# Altium schematic sheet Sheet1.SchDoc: Microcontroller part
size A; Author: K.Senthurbavan; DrawnBy: K Senthurbavan
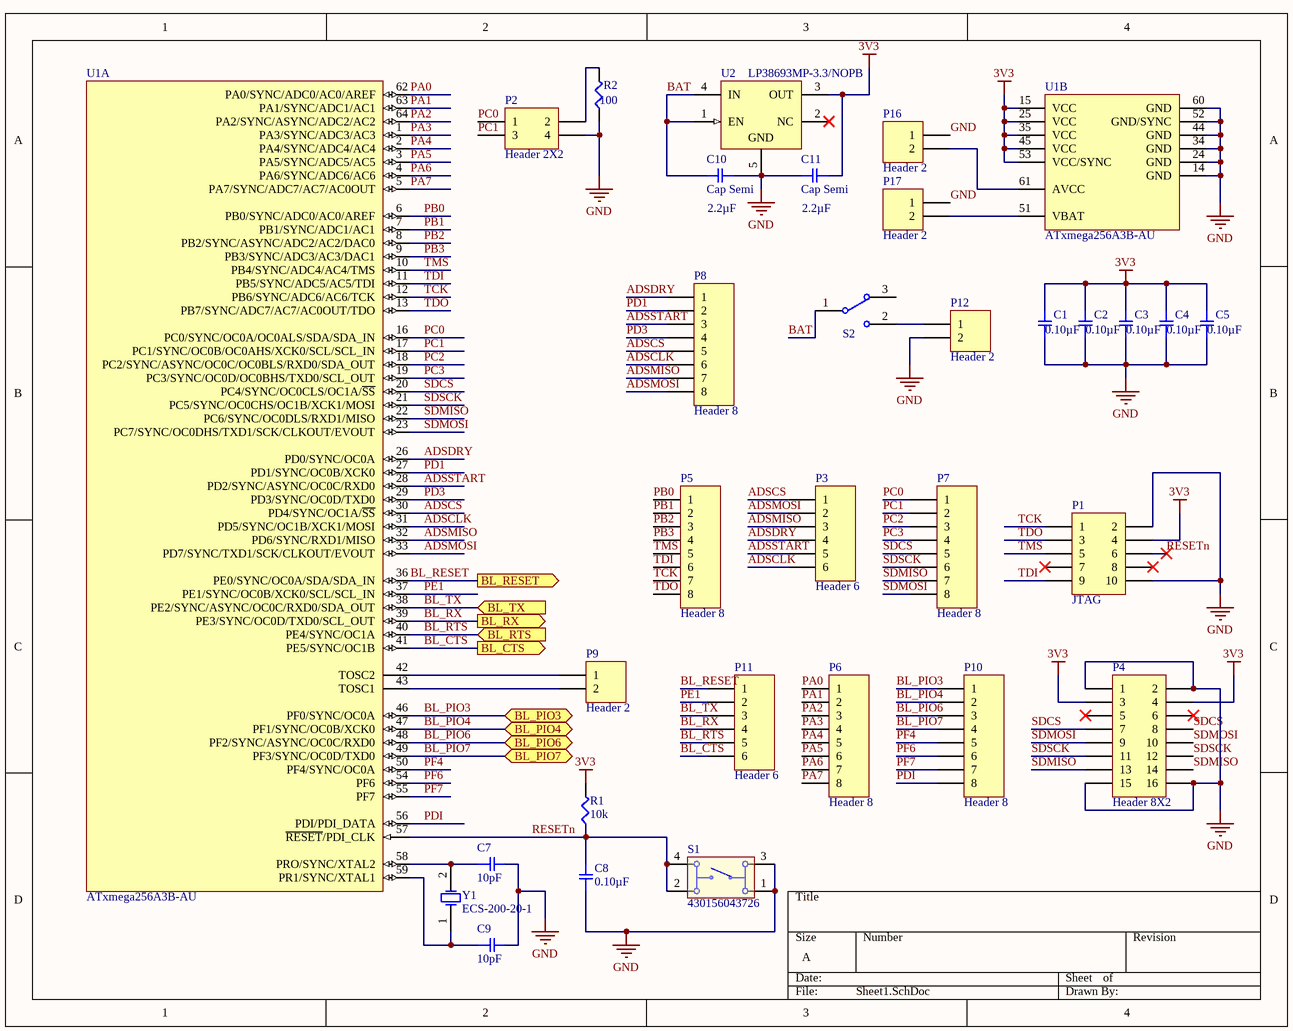
[diagram p0: Sheet1.SchDoc]

## Parts
C1  0.10µF  [SMD-0805C]
C2  0.10µF  [SMD-0805C]
C3  0.10µF  [SMD-0805C]
C4  0.10µF  [SMD-0805C]
C5  0.10µF  [SMD-0805C]
C7  10pF  [SMD-1206C]
C8  0.10µF  [SMD-0805C]
C9  10pF  [SMD-1206C]
C10  Cap Semi  value 2.2µF  [C1206]
C11  Cap Semi  value 2.2µF  [C1206]
P1  JTAG  [HDR2X5]
P2  Header 2X2  [HDR2X2]
P3  Header 6  [HDR1X6]
P4  Header 8X2  [HDR2X8]
P5  Header 8  [HDR1X8]
P6  Header 8  [HDR1X8]
P7  Header 8  [HDR1X8]
P8  Header 8  [HDR1X8]
P9  Header 2  [HDR1X2]
P10  Header 8  [HDR1X8]
P11  Header 6  [HDR1X6]
P12  Header 2  [HDR1X2]
P16  Header 2  [HDR1X2]
P17  Header 2  [HDR1X2]
R1  10k  [SMD-1206-RES]
R2  100  [SMD-0805-RES]
S1  430156043726  [430156043726]
S2  450301014042  [450301014042]  (value not drawn)
U1  ATxmega256A3B-AU  [64A_N]  (parts A,B of 2)
U2  LP38693MP-3.3/NOPB  [MP05A_N]
Y1  ECS-200-20-1  [HC-49U]

## Ports
BL_CTS (out), BL_PIO3 (bidir), BL_PIO4 (bidir), BL_PIO6 (bidir), BL_PIO7 (bidir), BL_RESET (out), BL_RTS (in), BL_RX (out), BL_TX (in)

## Nets
3V3: C1.2 C2.2 C3.2 C4.2 C5.2 C11.1 P1.4 P4.3 P4.4 R1.2 U1.15(VCC) U1.25(VCC) U1.35(VCC) U1.45(VCC) U1.53(VCC/SYNC) U2.3(OUT)
GND: C1.1 C2.1 C3.1 C4.1 C5.1 C7.2 C8.1 C9.2 C10.1 C11.2 P1.2 P1.10 P2.4 P4.1 P4.2 P4.15 P4.16 P12.2 P16.1 P17.1 R2.1 S1.1 S1.3 U1.14(GND) U1.24(GND) U1.34(GND) U1.44(GND) U1.52(GND/SYNC) U1.60(GND) U2.5(GND)
ADSCLK: P3.6 P8.6 U1.31(PD5/SYNC/OC1B/XCK1/MOSI)
ADSCS: P3.1 P8.5 U1.30(PD4/SYNC/OC1A/~{SS})
ADSDRY: P3.4 P8.1 U1.26(PD0/SYNC/OC0A)
ADSMISO: P3.3 P8.7 U1.32(PD6/SYNC/RXD1/MISO)
ADSMOSI: P3.2 P8.8 U1.33(PD7/SYNC/TXD1/SCK/CLKOUT/EVOUT)
ADSSTART: P3.5 P8.3 U1.28(PD2/SYNC/ASYNC/OC0C/RXD0)
BAT: C10.2 S2.1(COM) U2.1(EN) U2.4(IN)
BL_CTS: P11.6 U1.41(PE5/SYNC/OC1B) ; port BL_CTS
BL_PIO3: P10.1 U1.46(PF0/SYNC/OC0A) ; port BL_PIO3
BL_PIO4: P10.2 U1.47(PF1/SYNC/OC0B/XCK0) ; port BL_PIO4
BL_PIO6: P10.3 U1.48(PF2/SYNC/ASYNC/OC0C/RXD0) ; port BL_PIO6
BL_PIO7: P10.4 U1.49(PF3/SYNC/OC0D/TXD0) ; port BL_PIO7
BL_RESET: P11.1 U1.36(PE0/SYNC/OC0A/SDA/SDA_IN) ; port BL_RESET
BL_RTS: P11.5 U1.40(PE4/SYNC/OC1A) ; port BL_RTS
BL_RX: P11.4 U1.39(PE3/SYNC/OC0D/TXD0/SCL_OUT) ; port BL_RX
BL_TX: P11.3 U1.38(PE2/SYNC/ASYNC/OC0C/RXD0/SDA_OUT) ; port BL_TX
PA0: P6.1 U1.62(PA0/SYNC/ADC0/AC0/AREF)
PA1: P6.2 U1.63(PA1/SYNC/ADC1/AC1)
PA2: P6.3 U1.64(PA2/SYNC/ASYNC/ADC2/AC2)
PA3: P6.4 U1.1(PA3/SYNC/ADC3/AC3)
PA4: P6.5 U1.2(PA4/SYNC/ADC4/AC4)
PA5: P6.6 U1.3(PA5/SYNC/ADC5/AC5)
PA6: P6.7 U1.4(PA6/SYNC/ADC6/AC6)
PA7: P6.8 U1.5(PA7/SYNC/ADC7/AC7/AC0OUT)
PB0: P5.1 U1.6(PB0/SYNC/ADC0/AC0/AREF)
PB1: P5.2 U1.7(PB1/SYNC/ADC1/AC1)
PB2: P5.3 U1.8(PB2/SYNC/ASYNC/ADC2/AC2/DAC0)
PB3: P5.4 U1.9(PB3/SYNC/ADC3/AC3/DAC1)
PC0: P2.1 P7.1 U1.16(PC0/SYNC/OC0A/OC0ALS/SDA/SDA_IN)
PC1: P2.3 P7.2 U1.17(PC1/SYNC/OC0B/OC0AHS/XCK0/SCL/SCL_IN)
PC2: P7.3 U1.18(PC2/SYNC/ASYNC/OC0C/OC0BLS/RXD0/SDA_OUT)
PC3: P7.4 U1.19(PC3/SYNC/OC0D/OC0BHS/TXD0/SCL_OUT)
PD1: P8.2 U1.27(PD1/SYNC/OC0B/XCK0)
PD3: P8.4 U1.29(PD3/SYNC/OC0D/TXD0)
PDI: P10.8 U1.56(PDI/PDI_DATA)
PE1: P11.2 U1.37(PE1/SYNC/OC0B/XCK0/SCL/SCL_IN)
PF4: P10.5 U1.50(PF4/SYNC/OC0A)
PF6: P10.6 U1.54(PF6)
PF7: P10.7 U1.55(PF7)
RESETn: C8.2 P1.6 R1.1 S1.2 S1.4 U1.57(~{RESET}/PDI_CLK)
SDCS: P4.7 P4.8 P7.5 U1.20(PC4/SYNC/OC0CLS/OC1A/~{SS})
SDMISO: P4.13 P4.14 P7.7 U1.22(PC6/SYNC/OC0DLS/RXD1/MISO)
SDMOSI: P4.9 P4.10 P7.8 U1.23(PC7/SYNC/OC0DHS/TXD1/SCK/CLKOUT/EVOUT)
SDSCK: P4.11 P4.12 P7.6 U1.21(PC5/SYNC/OC0CHS/OC1B/XCK1/MOSI)
TCK: P1.1 P5.7 U1.12(PB6/SYNC/ADC6/AC6/TCK)
TDI: P1.9 P5.6 U1.11(PB5/SYNC/ADC5/AC5/TDI)
TDO: P1.3 P5.8 U1.13(PB7/SYNC/ADC7/AC7/AC0OUT/TDO)
TMS: P1.5 P5.5 U1.10(PB4/SYNC/ADC4/AC4/TMS)
NetC7_1: C7.1 U1.58(PRO/SYNC/XTAL2) Y1.2(OSC2)
NetC9_1: C9.1 U1.59(PR1/SYNC/XTAL1) Y1.1(OSC1)
NetP2_2: P2.2 R2.2
NetP9_1: P9.1 U1.42(TOSC2)
NetP9_2: P9.2 U1.43(TOSC1)
NetP12_1: P12.1 S2.2
NetP16_2: P16.2 U1.61(AVCC)
NetP17_2: P17.2 U1.51(VBAT)

Not connected (* = marked no-connect by the designer): P1 7* 8*; P4 5* 6*; S2 3; U2 2(NC)*

## Library data of the parts
C1-C5 C8 = GCD21BR71H104KA01L: CAP CER 0.1UF 50V X7R 0805; Manufacturer: Murata Electronics North America; Factory Stock: 0; Unit Price (USD): 0.24; Minimum Quantity: 1; Tolerance: ±10%; Value: 0.10µF; Datasheets: http://www.murata.com/~/media/webrenewal/support/library/catalog/products/capacitor/mlcc/c03e.ashx; Image: //media.digikey.com/Renders/Murata%20Renders/0805%28GxM6%29.jpg; Digi-Key Part Number: 490-11955-1-ND; Part Number: GCD21BR71H104KA01L; Quantity Available: 157; @ qty: 0; Packaging: Cut Tape (CT); Series: GCD; Part Status: Active; Voltage: 50V; Temperature Coefficient: X7R; Operating Temperature: -55°C ~ 125°C; Features: -; Ratings: AEC-Q200; Applications: Automotive; Mounting Type: Surface Mount, MLCC; Package / Case: 0805 (2012 Metric); Size / Dimension: 0.079" L x 0.049" W (2.00mm x 1.25mm); Height - Seated (Max): -; Thickness (Max): 0.049" (1.25mm); Lead Spacing: -; Lead Style: -
C7 C9 = GRM31A7U2J100JW31D: CAP CER 10PF 630V U2J 1206; Manufacturer: Murata Electronics North America; Factory Stock: 0; Unit Price (USD): 0.37; Minimum Quantity: 1; Tolerance: ±5%; Value: 10pF; Datasheets: http://www.murata.com/~/media/webrenewal/support/library/catalog/products/capacitor/mlcc/c02e.pdf; Image: //media.digikey.com/Renders/Murata%20Renders/GR331BD72E473KW01L.jpg; Digi-Key Part Number: 490-6495-1-ND; Part Number: GRM31A7U2J100JW31D; Quantity Available: 5199; @ qty: 0; Packaging: Cut Tape (CT); Series: GRM; Part Status: Active; Voltage: 630V; Temperature Coefficient: U2J; Operating Temperature: -55°C ~ 125°C; Features: -; Ratings: -; Applications: General Purpose; Mounting Type: Surface Mount, MLCC; Package / Case: 1206 (3216 Metric); Size / Dimension: 0.126" L x 0.063" W (3.20mm x 1.60mm); Height - Seated (Max): -; Thickness (Max): 0.039" (1.00mm); Lead Spacing: -; Lead Style: -
C10 C11 = GCJ31CR71H225KA12L: CAP CER 2.2UF 50V X7R 1206; Manufacturer: Murata Electronics North America; Factory Stock: 0; Unit Price (USD): 0.4; Minimum Quantity: 1; Tolerance: ±10%; Datasheets: http://www.murata.com/~/media/webrenewal/support/library/catalog/products/capacitor/mlcc/c03e.ashx; Image: //media.digikey.com/Renders/Murata%20Renders/GR331BD72E473KW01L.jpg; Digi-Key Part Number: 490-5809-1-ND; Part Number: GCJ31CR71H225KA12L; Quantity Available: 120717; @ qty: 0; Packaging: Cut Tape (CT); Series: GCJ; Part Status: Active; Voltage: 50V; Temperature Coefficient: X7R; Operating Temperature: -55°C ~ 125°C; Features: Soft Termination; Ratings: AEC-Q200; Applications: Automotive, Boardflex Sensitive; Mounting Type: Surface Mount, MLCC; Package / Case: 1206 (3216 Metric); Size / Dimension: 0.126" L x 0.063" W (3.20mm x 1.60mm); Height - Seated (Max): -; Thickness (Max): 0.075" (1.90mm); Lead Spacing: -; Lead Style: -
P1 = Header 5X2: Header, 5-Pin, Dual row; LatestRevisionDate: 17-Jul-2002; LatestRevisionNote: Re-released for DXP Platform.; Publisher: Altium Limited
P2 = Header 2X2: Header, 2-Pin, Dual row; LatestRevisionDate: 17-Jul-2002; LatestRevisionNote: Re-released for DXP Platform.; Publisher: Altium Limited
P3 P11 = Header 6: Header, 6-Pin; LatestRevisionDate: 17-Jul-2002; LatestRevisionNote: Re-released for DXP Platform.; Publisher: Altium Limited
P4 = Header 8X2: Header, 8-Pin, Dual row; LatestRevisionDate: 17-Jul-2002; LatestRevisionNote: Re-released for DXP Platform.; Publisher: Altium Limited
P5-P8 P10 = Header 8: Header, 8-Pin; LatestRevisionDate: 17-Jul-2002; LatestRevisionNote: Re-released for DXP Platform.; Publisher: Altium Limited
P9 P12 P16 P17 = Header 2: Header, 2-Pin; LatestRevisionDate: 17-Jul-2002; LatestRevisionNote: Re-released for DXP Platform.; Publisher: Altium Limited
R1 = ERJ-8ENF1002V: RES SMD 10K OHM 1% 1/4W 1206; Manufacturer: Panasonic Electronic Components; Factory Stock: 0; Unit Price (USD): 0.00933; @ qty: 1500; Minimum Quantity: 1; Power (Watts): 0.25W, 1/4W; Temperature Coefficient: ±100ppm/°C; Value: 10k; Part Number: ERJ-8ENF1002V; Datasheets: http://industrial.panasonic.com/www-cgi/jvcr13pz.cgi?E+PZ+3+AOA0002+ERJ8ENF1002V+7+WW; Image: //media.digikey.com/Renders/Panasonic%20Renders/ERJ-1206%20Pkg.jpg; Digi-Key Part Number: P10.0KFCT-ND; Quantity Available: 1108398; Packaging: Cut Tape (CT); Series: ERJ; Part Status: Active; Tolerance: ±1%; Composition: Thick Film; Features: Automotive AEC-Q200; Operating Temperature: -55°C ~ 155°C; Package / Case: 1206 (3216 Metric); Supplier Device Package: 1206; Size / Dimension: 0.126" L x 0.063" W (3.20mm x 1.60mm); Height - Seated (Max): 0.028" (0.70mm); Number of Terminations: 2; Failure Rate: -
R2 = ERJ-6ENF1000V: RES SMD 100 OHM 1% 1/8W 0805; Manufacturer: Panasonic Electronic Components; Factory Stock: 0; Unit Price (USD): 0.00729; @ qty: 1500; Minimum Quantity: 1; Power (Watts): 0.125W, 1/8W; Temperature Coefficient: ±100ppm/°C; Value: 100; Part Number: ERJ-6ENF1000V; Datasheets: http://industrial.panasonic.com/www-cgi/jvcr13pz.cgi?E+PZ+3+AOA0002+ERJ6ENF1000V+7+WW; Image: //media.digikey.com/Renders/Panasonic%20Renders/ERJ-0805%20Pkg.jpg; Digi-Key Part Number: P100CCT-ND; Quantity Available: 288663; Packaging: Cut Tape (CT); Series: ERJ; Part Status: Active; Tolerance: ±1%; Composition: Thick Film; Features: Automotive AEC-Q200; Operating Temperature: -55°C ~ 155°C; Package / Case: 0805 (2012 Metric); Supplier Device Package: 0805; Size / Dimension: 0.079" L x 0.049" W (2.00mm x 1.25mm); Height - Seated (Max): 0.028" (0.70mm); Number of Terminations: 2; Failure Rate: -
S1 = 430156043726: WS-TATV THT Tact Switch 6X6 mm; NoPins: 04; PackageReference: 430156043726; PartNumber: 430156043726; ComponentLink1Description: Manufacturer URL; ComponentLink1URL: http://www.we-online.com; ComponentLink2Description: Datasheet; ComponentLink2URL: http://katalog.we-online.de/em/datasheet/4301x6.pdf
S2 = 450301014042: 10x2.5mm THT WS-SLTV; Rated Current: 500 mA; Operation Force: 800 gf; Rated Voltage: 12 VDC; ComponentLink1Description: Manufacturer; ComponentLink1URL: http://www.we-online.de; ComponentLink2Description: Datasheet; ComponentLink2URL: http://katalog.we-online.de/em/datasheet/450301014042.pdf; Part Number: 450301014042; Published Date: Nov. 2017; Publisher: Wurth Elektronik; Life Cycle: 2000 steps; Operating Temperature: -40 to +85 degC; Size: 10x2.5x6.4 mm
U1 = ATxmega256A3B-AU: 8/16-bit AVR XMEGA A3B Microcontroller, 1.6-3.6V, 32MHz, 256KB + 8KB Flash, 4KB EEPROM, 16KB SRAM, 64-pin TQFP, Industrial Grade (-40°C to 85°C), Pb-Free; DatasheetVersion: revI, Sep-2010; PackageVersion: revC, Oct-2010; PackageReference: 64A; PackageDescription: 64-Pin Plastic Thin Profile Quad Flat Pack, 14 x 14 x 1.0 mm Body, 0.8 mm Pitch (TQFP); Code_JEDEC: MS-026-AEB; ComponentLink1Description: Manufacturer URL; ComponentLink1URL: http://www.atmel.com/; ComponentLink2Description: ATxmega256A3B Datasheet; ComponentLink2URL: http://www.atmel.com/dyn/resources/prod_documents/doc8116.pdf
U2 = LP38693MP-3.3/NOPB: 500mA Low Dropout CMOS Linear Regulators Stable with Ceramic Output Capacitors, 5-pin SOT-223, Pb-Free, 1000 Reel; Manufacturer: National Semiconductor; PackageTopMarking: XYTT*LJYB; PowerWise: Y; CompType: LDO IC; DatasheetVersion: Jun-2011; PackageVersion: revA, Jan-2000; PackageReference: MP05A; PackageDescription: Moldec SOT-223, 6.50 x 3.56 x 1.6mm Body, 5 Lead, 1.5mm Pitch; PartNumber: LP38693MP-3.3/NOPB; RoHS: Y; PinCount: 5; High-Reliability: Y; Code_JEDEC: TO-261-AB; Code_IPC: SOT223-5; ComponentLink1Description: Manufacturer URL; ComponentLink1URL: http://www.national.com/; ComponentLink2Description: LP38693 Datasheet; ComponentLink2URL: http://www.national.com/ds/LP/LP38691.pdf; ComponentLink3Description: LP38693 Web Page; ComponentLink3URL: http://www.national.com/pf/LP/LP38693.html; ComponentLink4Description: MP05A Package Page; ComponentLink4URL: http://www.national.com/packaging/folders/mp05a.html
Y1 = ECS-200-20-1: Crystal Oscillator; Published: 17-Jul-2002; PackageReference: HC-49U; Publisher: Altium Limited; DatasheetDocument: 18-Apr-2000; ComponentLink1Description: Manufacturer Link; ComponentLink1URL: http://www.ecsxtal.com/; ComponentLink2Description: Datasheet; ComponentLink2URL: http://www.ecsxtal.com/pdf2/HC49U.PDF